# Altium project Kenworth_Overview_2.PrjPcb (part 4 of 4)

## Sheet Filter.SchDoc: <Document>
size Letter; Engineer: <Engineer>; Organization: UPEL; Address1: USU Power Electronics Lab; Address2: USTAR Building 620, RM 118; Address3: 1600 N 620 E; Address4: North Logan, UT 84341; DocumentNumber: 14; Revision: v1; SheetNumber: 14; SheetTotal: 16; ProjectName: <Project>
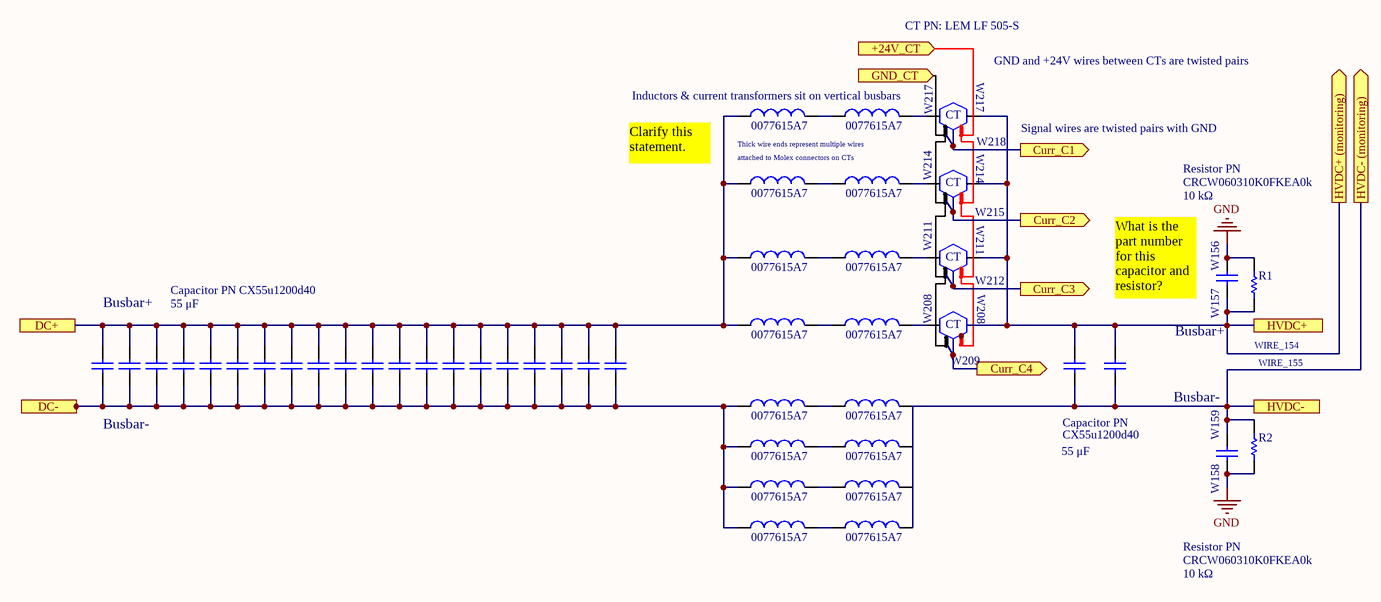
[diagram p15: Filter.SchDoc]

### Parts
(Parts that share a designator on the sheet are numbered #1, #2 ... from top to bottom, then left to right.)
*?#5  0077615A7
*?#6  0077615A7
*?#7  LEM LF 505-S  (value not drawn)
*?#8  0077615A7
*?#9  0077615A7
*?#10  LEM LF 505-S  (value not drawn)
*?#11  0077615A7
*?#12  0077615A7
*?#13  LEM LF 505-S  (value not drawn)
*?#14  0077615A7
*?#15  0077615A7
*?#16  CT PN: LEM LF 505-S
*?#17  0077615A7
*?#18  0077615A7
*?#19  0077615A7
*?#20  0077615A7
*?#21  0077615A7
*?#22  0077615A7
*?#23  0077615A7
*?#24  0077615A7
C?#1  Capacitor  (value not drawn)
C?#2  CX55u1200d40
C?#3  Capacitor PN CX55u1200d40
C?#4  Capacitor  (value not drawn)
C?#5  Capacitor  (value not drawn)
C?#6  Capacitor  (value not drawn)
C?#7  Capacitor  (value not drawn)
C?#8  Capacitor  (value not drawn)
C?#9  Capacitor  (value not drawn)
C?#10  Capacitor  (value not drawn)
C?#11  Capacitor  (value not drawn)
C?#12  Capacitor  (value not drawn)
C?#13  Capacitor  (value not drawn)
C?#14  Capacitor  (value not drawn)
C?#15  Capacitor  (value not drawn)
C?#16  Capacitor  (value not drawn)
C?#17  Capacitor  (value not drawn)
C?#18  Capacitor  (value not drawn)
C?#19  Capacitor  (value not drawn)
C?#20  Capacitor  (value not drawn)
C?#21  Capacitor  (value not drawn)
C?#22  Capacitor  (value not drawn)
C?#23  944U470K122AA  (value not drawn)
C?#24  Capacitor  (value not drawn)
R1  CRCW060310K0FKEA0k  [0603 RESISTOR]
R2  10k  [0603 RESISTOR]  (value not drawn)

### Ports
+24V_CT (in), Curr_C1 (out), Curr_C2 (out), Curr_C3 (out), Curr_C4 (out), DC+, DC-, GND_CT (in), HVDC+, HVDC+ (monitoring) (out), HVDC-, HVDC- (monitoring) (out)

### Nets
GND: C?#1.1 C?#24.1 R1.2 R2.2
DC+: C?#3.2 C?#4.2 C?#5.2 C?#6.2 C?#7.2 C?#8.2 C?#9.2 C?#10.2 C?#11.2 C?#12.2 C?#13.2 C?#14.2 C?#15.2 C?#16.2 C?#17.2 C?#18.2 C?#19.2 C?#20.2 C?#21.2 C?#22.2 ; port DC+
DC-: C?#3.1 C?#4.1 C?#5.1 C?#6.1 C?#7.1 C?#8.1 C?#9.1 C?#10.1 C?#11.1 C?#12.1 C?#13.1 C?#14.1 C?#15.1 C?#16.1 C?#17.1 C?#18.1 C?#19.1 C?#20.1 C?#21.1 C?#22.1 ; port DC-
HVDC+: *?#16.8 C?#1.2 C?#2.1 C?#23.2 R1.1 ; port HVDC+, port HVDC+ (monitoring)
HVDC-: C?#2.2 C?#23.1 C?#24.2 R2.1 ; port HVDC-, port HVDC- (monitoring)

Not connected (* = marked no-connect by the designer): *?#5 11 12; *?#6 11 12; *?#7 7 8; *?#8 11 12; *?#9 11 12; *?#10 7 8; *?#11 11 12; *?#12 11 12; *?#13 7 8; *?#14 11 12; *?#15 11 12; *?#16 7; *?#17 11 12; *?#18 11 12; *?#19 11 12; *?#20 11 12; *?#21 11 12; *?#22 11 12; *?#23 11 12; *?#24 11 12

### Notes on the sheet
- (near *?#7) W217
- (near *?#7) GND and +24V wires between CTs are twisted pairs
- (near *?#7) Inductors & current transformers sit on vertical busbars
- (near *?#5) Thick wire ends represent multiple wires
- (near *?#10) W214
- (near *?#7) W218
- (near *?#7) Signal wires are twisted pairs with GND
- (near *?#5) Clarify this statement.
- (near *?#8) attached to Molex connectors on CTs
- (near *?#10) W215
- 10 kΩ
- Resistor PN
- (near *?#13) W211
- (near *?#13) W212
- (near C?#1) W156
- (near C?#4) Busbar+
- (near C?#6) 55 μF
- (near *?#16) W208
- (near C?#1) What is the part number for this capacitor and resistor?
- Busbar+
- (near C?#1) W157
- WIRE_154
- (near *?#16) W209
- Busbar-
- WIRE_155
- (near C?#4) Busbar-
- 55 μF
- (near C?#23) Capacitor PN
- (near C?#24) W159
- (near C?#24) W158
- CRCW060310K0FKEA0k
- Project:
- Engineer:
- Document:
- Approved By:
- Date:
- Revision:
- File:
- Sheet
- of
- (in symbol Current_Sensor) CT

### Library data of the parts
*?#5 *?#6 *?#8 *?#9 *?#11 *?#12 *?#14 *?#15 *?#17-*?#24 = CMP-006-000014-3: 116.8 nH Toroid
*?#7 *?#10 *?#13 *?#16 = Current_Sensor
C?#1-C?#24 = Capacitor: SimulationGenericComponent: True; Value: 1p
R1 R2 = CRCW060310K0FKEA: 10 kOhms ±1% 0.1W, 1/10W Chip Resistor 0603 (1608 Metric) Automotive AEC-Q200 Thick Film; Supplier 1: Digi-Key; Supplier Part Number 1: 541-10.0KHCT-ND

## Sheet Rectifier.SchDoc: <Document>
size Letter; Engineer: <Engineer>; Organization: UPEL; Address1: USU Power Electronics Lab; Address2: USTAR Building 620, RM 118; Address3: 1600 N 620 E; Address4: North Logan, UT 84341; DocumentNumber: 13; Revision: v1; SheetNumber: 13; SheetTotal: 16; ProjectName: <Project>
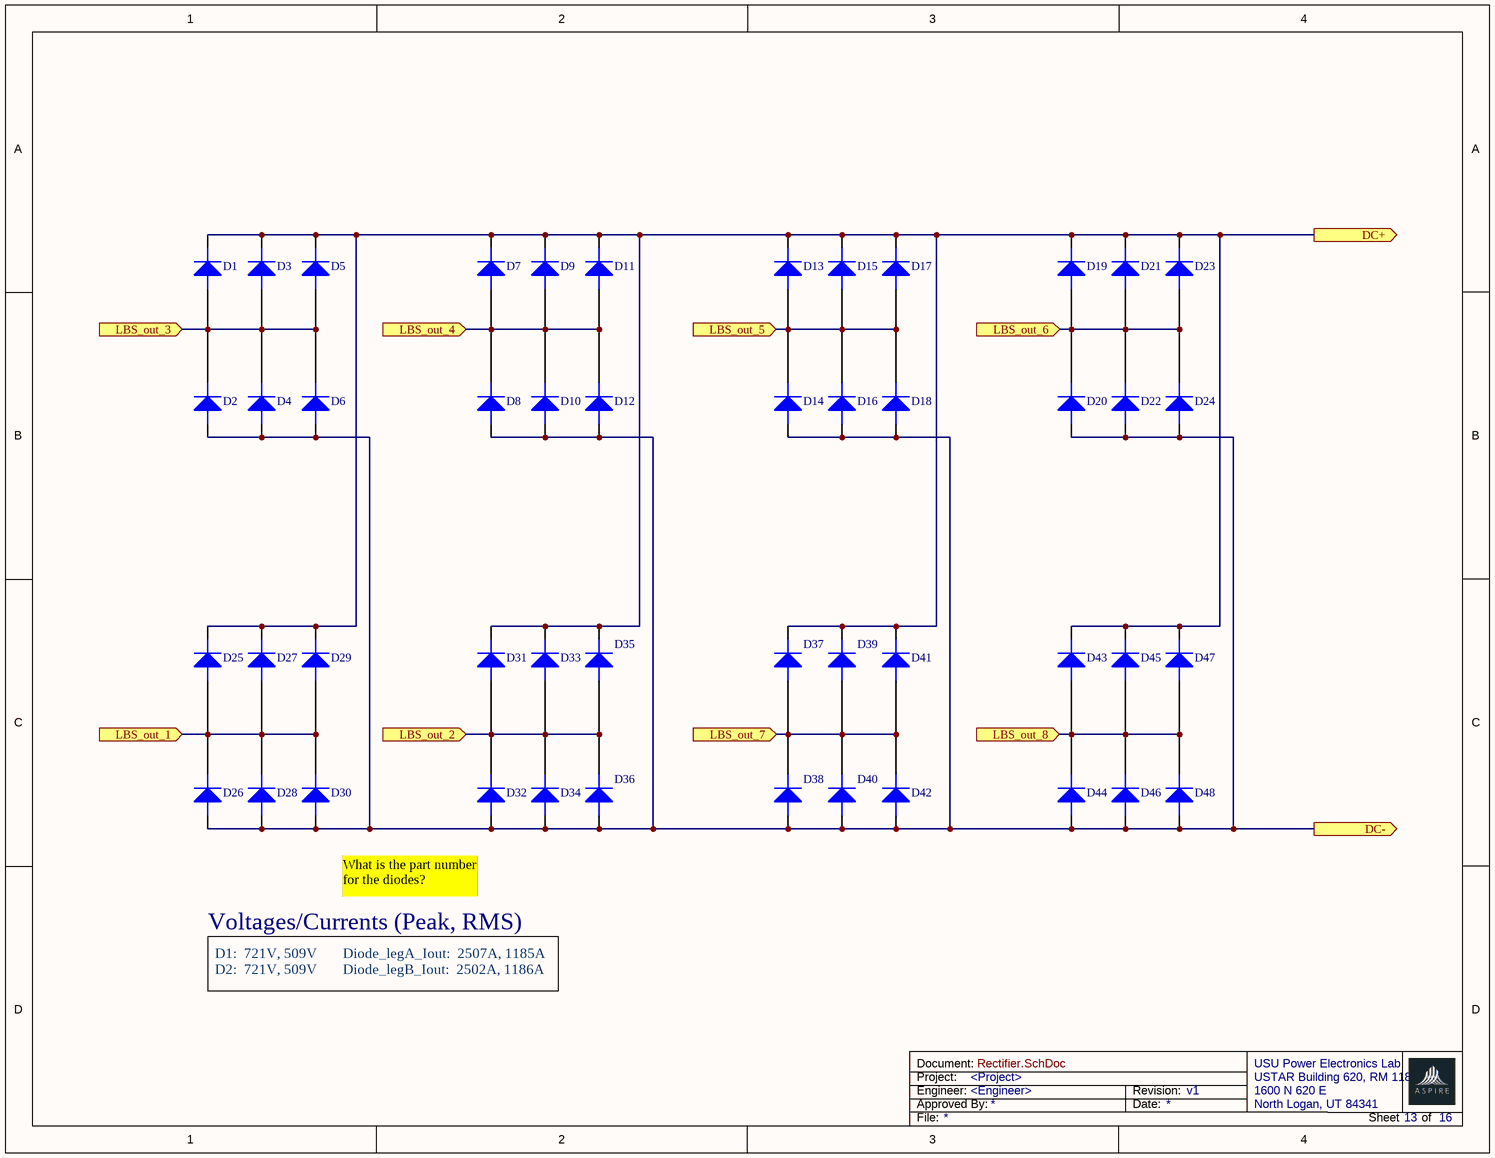
[diagram p16: Rectifier.SchDoc]

### Parts
(Parts that share a designator on the sheet are numbered #1, #2 ... from top to bottom, then left to right.)
D1#2  Diode  (value not drawn)
D2#2  Diode  (value not drawn)
D3#2  Diode  (value not drawn)
D4#2  Diode  (value not drawn)
D5#2  Diode  (value not drawn)
D6#2  Diode  (value not drawn)
D7  Diode  (value not drawn)
D8  Diode  (value not drawn)
D9  Diode  (value not drawn)
D10  Diode  (value not drawn)
D11  Diode  (value not drawn)
D12  Diode  (value not drawn)
D13  Diode  (value not drawn)
D14  Diode  (value not drawn)
D15  Diode  (value not drawn)
D16  Diode  (value not drawn)
D17  Diode  (value not drawn)
D18  Diode  (value not drawn)
D19  Diode  (value not drawn)
D20  Diode  (value not drawn)
D21  Diode  (value not drawn)
D22  Diode  (value not drawn)
D23  Diode  (value not drawn)
D24  Diode  (value not drawn)
D25  Diode  (value not drawn)
D26  Diode  (value not drawn)
D27  Diode  (value not drawn)
D28  Diode  (value not drawn)
D29  Diode  (value not drawn)
D30  Diode  (value not drawn)
D31  Diode  (value not drawn)
D32  Diode  (value not drawn)
D33  Diode  (value not drawn)
D34  Diode  (value not drawn)
D35  Diode  (value not drawn)
D36  Diode  (value not drawn)
D37  Diode  (value not drawn)
D38  Diode  (value not drawn)
D39  Diode  (value not drawn)
D40  Diode  (value not drawn)
D41  Diode  (value not drawn)
D42  Diode  (value not drawn)
D43  Diode  (value not drawn)
D44  Diode  (value not drawn)
D45  Diode  (value not drawn)
D46  Diode  (value not drawn)
D47  Diode  (value not drawn)
D48  Diode  (value not drawn)

### Ports
DC+ (out), DC- (out), LBS_out_1 (in), LBS_out_2 (in), LBS_out_3 (in), LBS_out_4 (in), LBS_out_5 (in), LBS_out_6 (in), LBS_out_7 (in), LBS_out_8 (in)

### Nets
DC+: D1#2.1 D3#2.1 D5#2.1 D7.1 D9.1 D11.1 D13.1 D15.1 D17.1 D19.1 D21.1 D23.1 D25.1 D27.1 D29.1 D31.1 D33.1 D35.1 D37.1 D39.1 D41.1 D43.1 D45.1 D47.1 ; port DC+
DC-: D2#2.0 D4#2.0 D6#2.0 D8.0 D10.0 D12.0 D14.0 D16.0 D18.0 D20.0 D22.0 D24.0 D26.0 D28.0 D30.0 D32.0 D34.0 D36.0 D38.0 D40.0 D42.0 D44.0 D46.0 D48.0 ; port DC-
LBS_out_1: D25.0 D26.1 D27.0 D28.1 D29.0 D30.1 ; port LBS_out_1
LBS_out_2: D31.0 D32.1 D33.0 D34.1 D35.0 D36.1 ; port LBS_out_2
LBS_out_3: D1#2.0 D2#2.1 D3#2.0 D4#2.1 D5#2.0 D6#2.1 ; port LBS_out_3
LBS_out_4: D7.0 D8.1 D9.0 D10.1 D11.0 D12.1 ; port LBS_out_4
LBS_out_5: D13.0 D14.1 D15.0 D16.1 D17.0 D18.1 ; port LBS_out_5
LBS_out_6: D19.0 D20.1 D21.0 D22.1 D23.0 D24.1 ; port LBS_out_6
LBS_out_7: D37.0 D38.1 D39.0 D40.1 D41.0 D42.1 ; port LBS_out_7
LBS_out_8: D43.0 D44.1 D45.0 D46.1 D47.0 D48.1 ; port LBS_out_8

### Notes on the sheet
- What is the part number for the diodes?
- Voltages/Currents (Peak, RMS)
- D1:  721V, 509V
  D2:  721V, 509V
- Diode_legA_Iout:  2507A, 1185A
  Diode_legB_Iout:  2502A, 1186A
- Project:
- Engineer:
- Document:
- Approved By:
- Date:
- Revision:
- File:
- Sheet
- of

## Sheet Underground_Assembly.SchDoc: <Document>
size Letter; Engineer: <Engineer>; Organization: UPEL; Address1: USU Power Electronics Lab; Address2: USTAR Building 620, RM 118; Address3: 1600 N 620 E; Address4: North Logan, UT 84341; DocumentNumber: 11; Revision: v1; SheetNumber: 11; SheetTotal: 16; ProjectName: <Project>
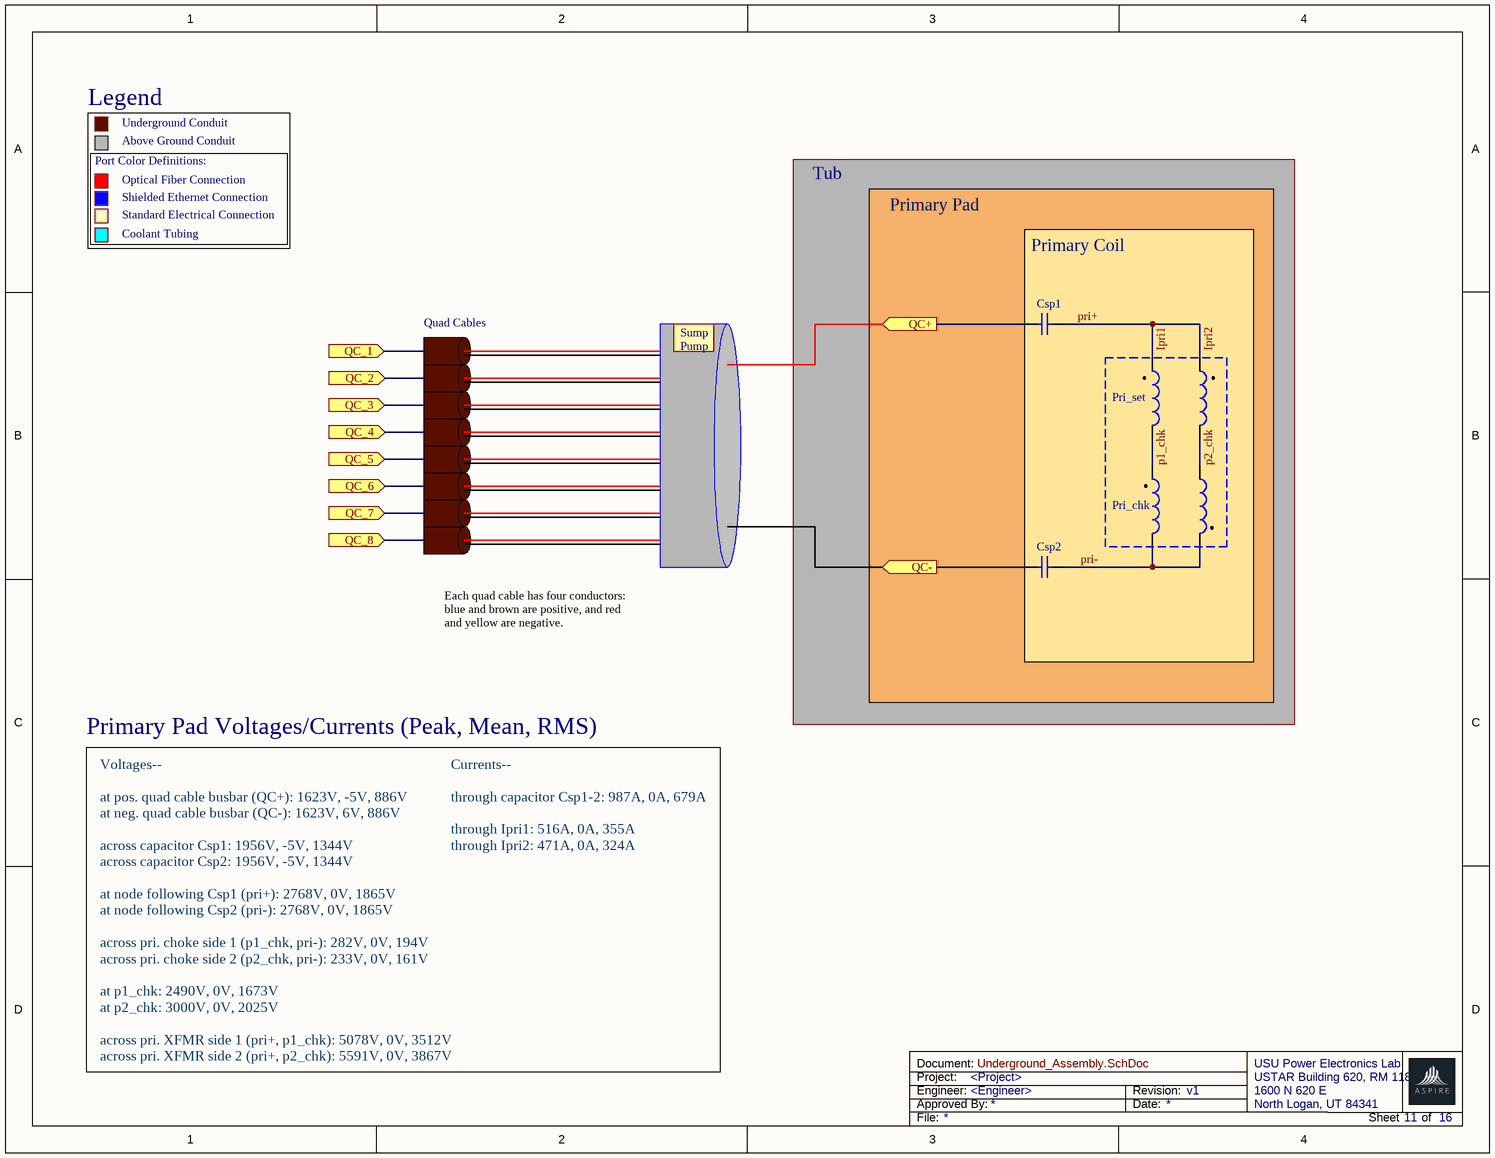
[diagram p17: Underground_Assembly.SchDoc]

### Parts
(Parts that share a designator on the sheet are numbered #1, #2 ... from top to bottom, then left to right.)
Csp1  Capacitor  (value not drawn)
Csp2  Capacitor  (value not drawn)
L?#11  Inductor  (value not drawn)
L?#12  Inductor  (value not drawn)
L?#13  Inductor  (value not drawn)
L?#14  Inductor  (value not drawn)

### Sub-sheets
Designator = File Name (file not in this document): no entries

### Ports
QC+ (in), QC- (in), QC_1 (in), QC_2 (in), QC_3 (in), QC_4 (in), QC_5 (in), QC_6 (in), QC_7 (in), QC_8 (in)

### Nets
Ipri1: Csp1.2 L?#11.2 L?#12.2  [also labelled Ipri2, pri+]
p1_chk: L?#11.1 L?#13.2
p2_chk: L?#12.1 L?#14.2
pri-: Csp2.2 L?#13.1 L?#14.1
QC+: Csp1.1 ; port QC+
QC-: Csp2.1 ; port QC-

### Notes on the sheet
- Legend
- Port Color Definitions:
- Underground Conduit
- Above Ground Conduit
- Optical Fiber Connection
- Shielded Ethernet Connection
- Standard Electrical Connection
- Coolant Tubing
- Tub
- Primary Pad
- Primary Coil
- Quad Cables
- Sump
  Pump
- (near L?#11) Pri_set
- (near L?#13) Pri_chk
- Each quad cable has four conductors: blue and brown are positive, and red and yellow are negative.
- Primary Pad Voltages/Currents (Peak, Mean, RMS)
- Currents--
  through capacitor Csp1-2: 987A, 0A, 679A
  through Ipri1: 516A, 0A, 355A
  through Ipri2: 471A, 0A, 324A
- Voltages--
  at pos. quad cable busbar (QC+): 1623V, -5V, 886V
  at neg. quad cable busbar (QC-): 1623V, 6V, 886V
  across capacitor Csp1: 1956V, -5V, 1344V
  across capacitor Csp2: 1956V, -5V, 1344V
  at node following Csp1 (pri+): 2768V, 0V, 1865V
  at node following Csp2 (pri-): 2768V, 0V, 1865V
  across pri. choke side 1 (p1_chk, pri-): 282V, 0V, 194V
  across pri. choke side 2 (p2_chk, pri-): 233V, 0V, 161V
  at p1_chk: 2490V, 0V, 1673V
  at p2_chk: 3000V, 0V, 2025V
  across pri. XFMR side 1 (pri+, p1_chk): 5078V, 0V, 3512V
  across pri. XFMR side 2 (pri+, p2_chk): 5591V, 0V, 3867V
- Project:
- Engineer:
- Document:
- Approved By:
- Date:
- Revision:
- File:
- Sheet
- of

### Library data of the parts
Csp1 = Capacitor: SimulationGenericComponent: True; Value: 1.66uF
Csp2 = Capacitor: SimulationGenericComponent: True; Value: 2.22uF
L?#11-L?#14 = Inductor: SimulationGenericComponent: True; Value: 1u

## Sheet Secondary_Pad_Auxiliary_Wiring_Overview.SchDoc
size A
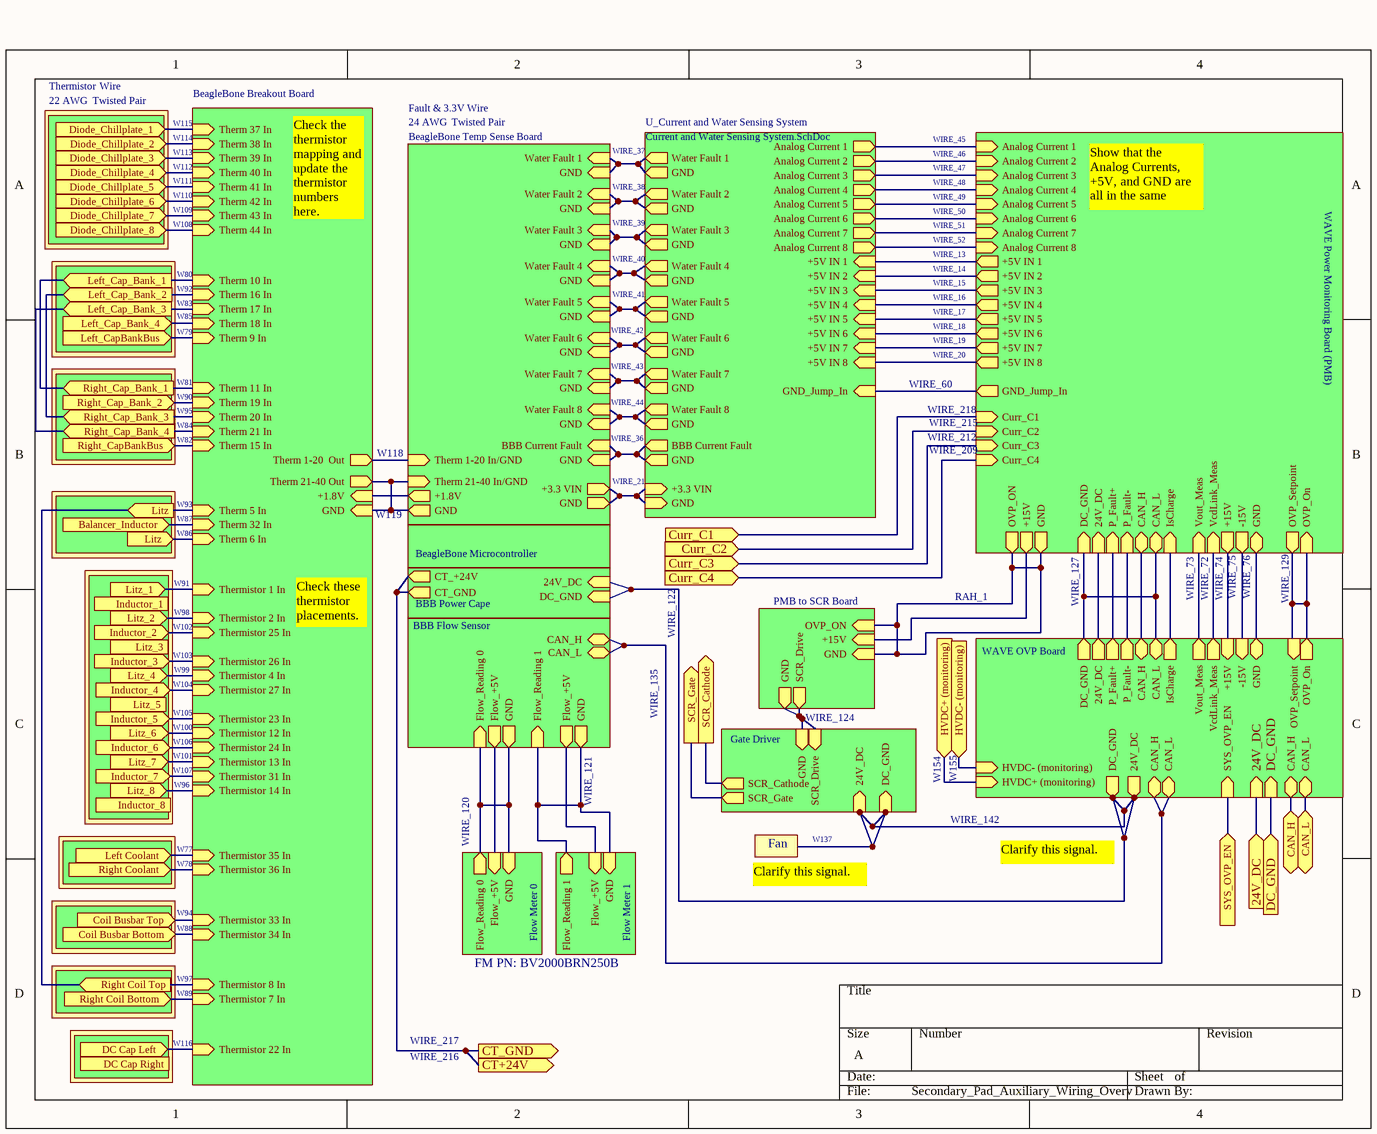
[diagram p18: Secondary_Pad_Auxiliary_Wiring_Overview.SchDoc]

### Sub-sheets
BBB Flow Sensor = File Name (file not in this document): CAN_H (bidir), CAN_L (bidir), Flow_+5V (out), GND (out), Flow_Reading 1 (in), Flow_Reading 0 (in), Flow_+5V (out), GND (out)
BBB Power Cape = File Name (file not in this document): DC_GND (in), 24V_DC (in), CT_GND (out), CT_+24V (out)
BeagleBone Breakout Board = BeagleBone Breakout Board (file not in this document): Therm 37 In (in), Therm 38 In (in), Therm 39 In (in), Therm 40 In (in), Therm 41 In (in), Therm 42 In (in), Therm 43 In (in), Therm 44 In (in), Therm 10 In (in), Therm 16 In (in), Therm 17 In (in), Therm 18 In (in), Therm 9 In (in), Therm 20 In (in), Therm 19 In (in), Therm 11 In (in), Therm 21 In (in), Therm 15 In (in), Therm 5 In (in), Therm 32 In (in), Therm 6 In (in), Thermistor 1 In (in), Thermistor 24 In (in), Thermistor 2 In (in), Thermistor 25 In (in), Thermistor 26 In (in), Thermistor 4 In (in), Thermistor 12 In (in), Thermistor 31 In (in), Thermistor 14 In (in), Thermistor 13 In (in), Therm 1-20  Out (out), Therm 21-40 Out (out), Thermistor 27 In (in), Thermistor 35 In (in), Thermistor 36 In (in), Thermistor 8 In (in), Thermistor 7 In (in), Thermistor 22 In (in), Thermistor 23 In (in), Thermistor 33 In (in), Thermistor 34 In (in), +1.8V (in), GND (in)
BeagleBone Microcontroller = File Name (file not in this document): no entries
BeagleBone Temp Sense Board = File Name (file not in this document): Water Fault 1 (in), Water Fault 5 (in), Water Fault 2 (in), Water Fault 4 (in), Water Fault 6 (in), Water Fault 7 (in), BBB Current Fault (in), Water Fault 8 (in), Therm 1-20 In/GND (in), Therm 21-40 In/GND (in), Water Fault 3 (in), GND (in), GND (in), GND (in), GND (in), GND (in), GND (in), GND (in), GND (in), GND (in), +1.8V (out), GND (out), +3.3 VIN (out), GND (out)
Coil 4 = File Name (file not in this document): no entries
Coil 4 = File Name (file not in this document): no entries
Coil 4 = File Name (file not in this document): no entries
Coil 4 = File Name (file not in this document): no entries
Coil 4 = File Name (file not in this document): no entries
Coil 4 = File Name (file not in this document): no entries
Coil 4 = File Name (file not in this document): no entries
Coil 4 = File Name (file not in this document): no entries
Coil 4 = File Name (file not in this document): no entries
Designator = WAVE OVP Board (file not in this document): Vout_Meas (out), VcdLink_Meas (out), GND (bidir), +15V (in), OVP_On (out), OVP_Setpoint (in), -15V (in), IsCharge (out), P_Fault- (out), P_Fault+ (out), 24V_DC (out), DC_GND (out), CAN_H (bidir), CAN_L (bidir), 24V_DC (in), DC_GND (in), SYS_OVP_EN (in), CAN_H (bidir), CAN_L (bidir), 24V_DC (out), DC_GND (out), CAN_H (bidir), CAN_L (bidir), HVDC- (monitoring) (in), HVDC+ (monitoring) (in)
Flow Meter 0 = File Name (file not in this document): Flow_Reading 0 (out), Flow_+5V (in), GND (in)
Flow Meter 1 = File Name (file not in this document): Flow_Reading 1 (out), Flow_+5V (in), GND (in)
Gate Driver = File Name (file not in this document): SCR_Drive (in), GND (in), SCR_Cathode (out), SCR_Gate (out), DC_GND (in), 24V_DC (in)
PMB to SCR Board = File Name (file not in this document): GND (in), OVP_ON (in), SCR_Drive (out), GND (out), +15V (in)
U_Current and Water Sensing System = Current and Water Sensing System.SchDoc (file not in this document): Water Fault 1 (out), Water Fault 2 (out), Water Fault 3 (out), Water Fault 4 (out), Water Fault 5 (out), Water Fault 6 (out), Water Fault 7 (out), Water Fault 8 (out), BBB Current Fault (out), Analog Current 1 (out), Analog Current 2 (out), Analog Current 3 (out), Analog Current 4 (out), Analog Current 5 (out), Analog Current 6 (out), Analog Current 7 (out), Analog Current 8 (out), +5V IN 1 (in), +5V IN 2 (in), +5V IN 3 (in), +5V IN 4 (in), +5V IN 5 (in), +5V IN 6 (in), +5V IN 7 (in), +5V IN 8 (in), GND (out), GND (out), GND (out), GND (out), GND (out), GND (out), GND (out), GND (out), GND (out), GND_Jump_In (in), +3.3 VIN (in), GND (in)
WAVE Power Monitoring Board (PMB) = File Name (file not in this document): +5V IN 1 (out), +5V IN 2 (out), +5V IN 3 (out), +5V IN 4 (out), +5V IN 5 (out), +5V IN 6 (out), +5V IN 7 (out), +5V IN 8 (out), Vout_Meas (in), VcdLink_Meas (in), GND (bidir), -15V (out), +15V (out), IsCharge (in), P_Fault- (in), P_Fault+ (in), Analog Current 1 (in), Analog Current 2 (in), Analog Current 3 (in), Analog Current 4 (in), Analog Current 5 (in), Analog Current 6 (in), Analog Current 7 (in), Analog Current 8 (in), GND_Jump_In (out), 24V_DC (in), DC_GND (in), OVP_Setpoint (out), OVP_On (in), Curr_C2 (in), Curr_C1 (in), Curr_C4 (in), Curr_C3 (in), CAN_H (bidir), CAN_L (bidir), +15V (out), OVP_ON (out), GND (out)

### Ports
24V_DC (in), Balancer_Inductor (in), CAN_H (bidir), CAN_L (bidir), Coil Busbar Bottom (in), Coil Busbar Top (in), CT+24V (out), CT_GND (out), Curr_C1 (in), Curr_C2 (in), Curr_C3 (in), Curr_C4 (in), DC Cap Left (in), DC Cap Right (in), DC_GND (in), Diode_Chillplate_1 (in), Diode_Chillplate_2 (in), Diode_Chillplate_3 (in), Diode_Chillplate_4 (in), Diode_Chillplate_5 (in), Diode_Chillplate_6 (in), Diode_Chillplate_7 (in), Diode_Chillplate_8 (in), HVDC+ (monitoring) (in), HVDC- (monitoring) (in), Inductor_1 (in), Inductor_2 (in), Inductor_3 (in), Inductor_4 (in), Inductor_5 (in), Inductor_6 (in), Inductor_7 (in), Inductor_8 (in), Left Coolant (in), Left_Cap_Bank_1 (in), Left_Cap_Bank_2 (in), Left_Cap_Bank_3 (in), Left_Cap_Bank_4 (in), Left_CapBankBus (in), Litz (in), Litz_1 (in), Litz_2 (in), Litz_3 (in), Litz_4 (in), Litz_5 (in), Litz_6 (in), Litz_7 (in), Litz_8 (in), Right Coil Bottom (in), Right Coil Top (in), Right Coolant (in), Right_Cap_Bank_1 (in), Right_Cap_Bank_2 (in), Right_Cap_Bank_3 (in), Right_Cap_Bank_4 (in), Right_CapBankBus (in), SCR_Cathode (out), SCR_Gate (out), SYS_OVP_EN (in)

### Nets
24V_DC: port 24V_DC, sheet Designator/24V_DC
Balancer_Inductor: port Balancer_Inductor, sheet BeagleBone Breakout Board/Therm 32 In
CAN_H: port CAN_H, sheet Designator/CAN_H
CAN_L: port CAN_L, sheet Designator/CAN_L
Coil Busbar Bottom: port Coil Busbar Bottom, sheet BeagleBone Breakout Board/Thermistor 34 In
Coil Busbar Top: port Coil Busbar Top, sheet BeagleBone Breakout Board/Thermistor 33 In
CT+24V: port CT_GND, port CT+24V, sheet BBB Power Cape/CT_GND, sheet BBB Power Cape/CT_+24V
Curr_C1: port Curr_C1, sheet WAVE Power Monitoring Board (PMB)/Curr_C1
Curr_C2: port Curr_C2, sheet WAVE Power Monitoring Board (PMB)/Curr_C2
Curr_C3: port Curr_C3, sheet WAVE Power Monitoring Board (PMB)/Curr_C3
Curr_C4: port Curr_C4, sheet WAVE Power Monitoring Board (PMB)/Curr_C4
DC Cap Left: port DC Cap Left, sheet BeagleBone Breakout Board/Thermistor 22 In
DC_GND: port DC_GND, sheet Designator/DC_GND
Diode_Chillplate_1: port Diode_Chillplate_1, sheet BeagleBone Breakout Board/Therm 37 In
Diode_Chillplate_2: port Diode_Chillplate_2, sheet BeagleBone Breakout Board/Therm 38 In
Diode_Chillplate_3: port Diode_Chillplate_3, sheet BeagleBone Breakout Board/Therm 39 In
Diode_Chillplate_4: port Diode_Chillplate_4, sheet BeagleBone Breakout Board/Therm 40 In
Diode_Chillplate_5: port Diode_Chillplate_5, sheet BeagleBone Breakout Board/Therm 41 In
Diode_Chillplate_6: port Diode_Chillplate_6, sheet BeagleBone Breakout Board/Therm 42 In
Diode_Chillplate_7: port Diode_Chillplate_7, sheet BeagleBone Breakout Board/Therm 43 In
Diode_Chillplate_8: port Diode_Chillplate_8, sheet BeagleBone Breakout Board/Therm 44 In
HVDC+ (monitoring): port HVDC+ (monitoring), sheet Designator/HVDC+ (monitoring)
HVDC- (monitoring): port HVDC- (monitoring), sheet Designator/HVDC- (monitoring)
Inductor_2: port Inductor_2, sheet BeagleBone Breakout Board/Thermistor 25 In
Inductor_3: port Inductor_3, sheet BeagleBone Breakout Board/Thermistor 26 In
Inductor_4: port Inductor_4, sheet BeagleBone Breakout Board/Thermistor 27 In
Inductor_5: port Inductor_5, sheet BeagleBone Breakout Board/Thermistor 23 In
Inductor_6: port Inductor_6, sheet BeagleBone Breakout Board/Thermistor 24 In
Inductor_7: port Inductor_7, sheet BeagleBone Breakout Board/Thermistor 31 In
Left Coolant: port Left Coolant, sheet BeagleBone Breakout Board/Thermistor 35 In
Left_Cap_Bank_1: port Right_Cap_Bank_1, port Left_Cap_Bank_1, sheet BeagleBone Breakout Board/Therm 10 In, sheet BeagleBone Breakout Board/Therm 11 In
Left_Cap_Bank_2: port Right_Cap_Bank_3, port Left_Cap_Bank_2, sheet BeagleBone Breakout Board/Therm 16 In, sheet BeagleBone Breakout Board/Therm 20 In
Left_Cap_Bank_3: port Right_Cap_Bank_4, port Left_Cap_Bank_3, sheet BeagleBone Breakout Board/Therm 17 In, sheet BeagleBone Breakout Board/Therm 21 In
Left_Cap_Bank_4: port Left_Cap_Bank_4, sheet BeagleBone Breakout Board/Therm 18 In
Left_CapBankBus: port Left_CapBankBus, sheet BeagleBone Breakout Board/Therm 9 In
Litz: port Litz, port Right Coil Top, sheet BeagleBone Breakout Board/Therm 5 In, sheet BeagleBone Breakout Board/Therm 6 In, sheet BeagleBone Breakout Board/Thermistor 8 In
Litz_1: port Litz_1, sheet BeagleBone Breakout Board/Thermistor 1 In
Litz_2: port Litz_2, sheet BeagleBone Breakout Board/Thermistor 2 In
Litz_4: port Litz_4, sheet BeagleBone Breakout Board/Thermistor 4 In
Litz_6: port Litz_6, sheet BeagleBone Breakout Board/Thermistor 12 In
Litz_7: port Litz_7, sheet BeagleBone Breakout Board/Thermistor 13 In
Litz_8: port Litz_8, sheet BeagleBone Breakout Board/Thermistor 14 In
Right Coil Bottom: port Right Coil Bottom, sheet BeagleBone Breakout Board/Thermistor 7 In
Right Coolant: port Right Coolant, sheet BeagleBone Breakout Board/Thermistor 36 In
Right_Cap_Bank_2: port Right_Cap_Bank_2, sheet BeagleBone Breakout Board/Therm 19 In
Right_CapBankBus: port Right_CapBankBus, sheet BeagleBone Breakout Board/Therm 15 In
SCR_Cathode: port SCR_Cathode, sheet Gate Driver/SCR_Cathode
SCR_Gate: port SCR_Gate, sheet Gate Driver/SCR_Gate
SYS_OVP_EN: port SYS_OVP_EN, sheet Designator/SYS_OVP_EN
(unnamed): sheet BBB Power Cape/24V_DC, sheet Gate Driver/DC_GND, sheet Gate Driver/24V_DC, sheet Designator/24V_DC, sheet Designator/DC_GND
(unnamed): sheet BBB Flow Sensor/CAN_H, sheet BBB Flow Sensor/CAN_L, sheet Designator/CAN_H, sheet Designator/CAN_L
(unnamed): sheet BBB Flow Sensor/Flow_+5V, sheet Flow Meter 0/Flow_+5V
(unnamed): sheet BBB Flow Sensor/GND, sheet BBB Flow Sensor/Flow_Reading 0, sheet Flow Meter 0/Flow_Reading 0, sheet Flow Meter 0/GND
(unnamed): sheet BBB Flow Sensor/Flow_Reading 1, sheet BBB Flow Sensor/GND, sheet Flow Meter 1/Flow_Reading 1, sheet Flow Meter 1/GND
(unnamed): sheet BBB Flow Sensor/Flow_+5V, sheet Flow Meter 1/Flow_+5V
(unnamed): sheet BeagleBone Temp Sense Board/Water Fault 1, sheet BeagleBone Temp Sense Board/GND, sheet U_Current and Water Sensing System/Water Fault 1, sheet U_Current and Water Sensing System/GND
(unnamed): sheet BeagleBone Temp Sense Board/Water Fault 5, sheet BeagleBone Temp Sense Board/GND, sheet U_Current and Water Sensing System/Water Fault 5, sheet U_Current and Water Sensing System/GND
(unnamed): sheet BeagleBone Temp Sense Board/Water Fault 2, sheet BeagleBone Temp Sense Board/GND, sheet U_Current and Water Sensing System/Water Fault 2, sheet U_Current and Water Sensing System/GND
(unnamed): sheet BeagleBone Temp Sense Board/Water Fault 4, sheet BeagleBone Temp Sense Board/GND, sheet U_Current and Water Sensing System/Water Fault 4, sheet U_Current and Water Sensing System/GND
(unnamed): sheet BeagleBone Temp Sense Board/Water Fault 6, sheet BeagleBone Temp Sense Board/GND, sheet U_Current and Water Sensing System/Water Fault 6, sheet U_Current and Water Sensing System/GND
(unnamed): sheet BeagleBone Temp Sense Board/Water Fault 7, sheet BeagleBone Temp Sense Board/GND, sheet U_Current and Water Sensing System/Water Fault 7, sheet U_Current and Water Sensing System/GND
(unnamed): sheet BeagleBone Temp Sense Board/BBB Current Fault, sheet BeagleBone Temp Sense Board/GND, sheet U_Current and Water Sensing System/BBB Current Fault, sheet U_Current and Water Sensing System/GND
(unnamed): sheet BeagleBone Temp Sense Board/Water Fault 8, sheet BeagleBone Temp Sense Board/GND, sheet U_Current and Water Sensing System/Water Fault 8, sheet U_Current and Water Sensing System/GND
(unnamed): sheet BeagleBone Temp Sense Board/Therm 1-20 In/GND, sheet BeagleBone Breakout Board/Therm 1-20  Out
(unnamed): sheet BeagleBone Temp Sense Board/Therm 21-40 In/GND, sheet BeagleBone Temp Sense Board/GND, sheet BeagleBone Breakout Board/Therm 21-40 Out, sheet BeagleBone Breakout Board/GND
(unnamed): sheet BeagleBone Temp Sense Board/Water Fault 3, sheet BeagleBone Temp Sense Board/GND, sheet U_Current and Water Sensing System/Water Fault 3, sheet U_Current and Water Sensing System/GND
(unnamed): sheet BeagleBone Temp Sense Board/+1.8V, sheet BeagleBone Breakout Board/+1.8V
(unnamed): sheet BeagleBone Temp Sense Board/+3.3 VIN, sheet BeagleBone Temp Sense Board/GND, sheet U_Current and Water Sensing System/+3.3 VIN, sheet U_Current and Water Sensing System/GND
(unnamed): sheet U_Current and Water Sensing System/Analog Current 1, sheet WAVE Power Monitoring Board (PMB)/Analog Current 1
(unnamed): sheet U_Current and Water Sensing System/Analog Current 2, sheet WAVE Power Monitoring Board (PMB)/Analog Current 2
(unnamed): sheet U_Current and Water Sensing System/Analog Current 3, sheet WAVE Power Monitoring Board (PMB)/Analog Current 3
(unnamed): sheet U_Current and Water Sensing System/Analog Current 4, sheet WAVE Power Monitoring Board (PMB)/Analog Current 4
(unnamed): sheet U_Current and Water Sensing System/Analog Current 5, sheet WAVE Power Monitoring Board (PMB)/Analog Current 5
(unnamed): sheet U_Current and Water Sensing System/Analog Current 6, sheet WAVE Power Monitoring Board (PMB)/Analog Current 6
(unnamed): sheet U_Current and Water Sensing System/Analog Current 7, sheet WAVE Power Monitoring Board (PMB)/Analog Current 7
(unnamed): sheet U_Current and Water Sensing System/Analog Current 8, sheet WAVE Power Monitoring Board (PMB)/Analog Current 8
(unnamed): sheet U_Current and Water Sensing System/+5V IN 1, sheet WAVE Power Monitoring Board (PMB)/+5V IN 1
(unnamed): sheet U_Current and Water Sensing System/+5V IN 2, sheet WAVE Power Monitoring Board (PMB)/+5V IN 2
(unnamed): sheet U_Current and Water Sensing System/+5V IN 3, sheet WAVE Power Monitoring Board (PMB)/+5V IN 3
(unnamed): sheet U_Current and Water Sensing System/+5V IN 4, sheet WAVE Power Monitoring Board (PMB)/+5V IN 4
(unnamed): sheet U_Current and Water Sensing System/+5V IN 5, sheet WAVE Power Monitoring Board (PMB)/+5V IN 5
(unnamed): sheet U_Current and Water Sensing System/+5V IN 6, sheet WAVE Power Monitoring Board (PMB)/+5V IN 6
(unnamed): sheet U_Current and Water Sensing System/+5V IN 7, sheet WAVE Power Monitoring Board (PMB)/+5V IN 7
(unnamed): sheet U_Current and Water Sensing System/+5V IN 8, sheet WAVE Power Monitoring Board (PMB)/+5V IN 8
(unnamed): sheet U_Current and Water Sensing System/GND_Jump_In, sheet WAVE Power Monitoring Board (PMB)/GND_Jump_In
(unnamed): sheet WAVE Power Monitoring Board (PMB)/Vout_Meas, sheet Designator/Vout_Meas
(unnamed): sheet WAVE Power Monitoring Board (PMB)/VcdLink_Meas, sheet Designator/VcdLink_Meas
(unnamed): sheet WAVE Power Monitoring Board (PMB)/GND, sheet Designator/GND
(unnamed): sheet WAVE Power Monitoring Board (PMB)/-15V, sheet Designator/-15V
(unnamed): sheet WAVE Power Monitoring Board (PMB)/+15V, sheet Designator/+15V
(unnamed): sheet WAVE Power Monitoring Board (PMB)/IsCharge, sheet Designator/IsCharge
(unnamed): sheet WAVE Power Monitoring Board (PMB)/P_Fault-, sheet Designator/P_Fault-
(unnamed): sheet WAVE Power Monitoring Board (PMB)/P_Fault+, sheet Designator/P_Fault+
(unnamed): sheet WAVE Power Monitoring Board (PMB)/24V_DC, sheet Designator/24V_DC
(unnamed): sheet WAVE Power Monitoring Board (PMB)/DC_GND, sheet WAVE Power Monitoring Board (PMB)/CAN_L, sheet Designator/DC_GND, sheet Designator/CAN_L
(unnamed): sheet WAVE Power Monitoring Board (PMB)/OVP_Setpoint, sheet WAVE Power Monitoring Board (PMB)/OVP_On, sheet Designator/OVP_On
(unnamed): sheet WAVE Power Monitoring Board (PMB)/CAN_H, sheet Designator/CAN_H
(unnamed): sheet WAVE Power Monitoring Board (PMB)/+15V, sheet PMB to SCR Board/+15V
(unnamed): sheet WAVE Power Monitoring Board (PMB)/OVP_ON, sheet WAVE Power Monitoring Board (PMB)/GND, sheet PMB to SCR Board/OVP_ON
(unnamed): sheet PMB to SCR Board/SCR_Drive, sheet PMB to SCR Board/GND, sheet Gate Driver/SCR_Drive, sheet Gate Driver/GND

### Notes on the sheet
- 22 AWG
- Thermistor
- Twisted Pair
- Wire
- W115
- W114
- W113
- 24 AWG
- Fault & 3.3V Wire
- WIRE_37
- WIRE_45
- W112
- W111
- W110
- W109
- Check the thermistor mapping and update the thermistor numbers here.
- WIRE_38
- WIRE_39
- WIRE_46
- WIRE_47
- WIRE_48
- WIRE_49
- WIRE_50
- Show that the Analog Currents, +5V, and GND are all in the same insulated jacket.
- W108
- W80
- W92
- WIRE_40
- WIRE_41
- WIRE_13
- WIRE_14
- WIRE_15
- WIRE_51
- WIRE_52
- W83
- W85
- W79
- WIRE_42
- WIRE_43
- WIRE_16
- WIRE_17
- WIRE_18
- WIRE_20
- WIRE_19
- W81
- W90
- W95
- W84
- W82
- WIRE_44
- WIRE_36
- WIRE_60
- WIRE_218
- WIRE_212
- WIRE_215
- W93
- W118
- WIRE_21
- WIRE_209
- W91
- W87
- W86
- W119
- W102
- W98
- Check these thermistor placements.
- WIRE_122
- RAH_1
- WIRE_127
- WIRE_73
- WIRE_72
- WIRE_74
- WIRE_75
- WIRE_76
- WIRE_129
- W103
- W104
- W105
- W100
- W99
- WIRE_135
- WIRE_124
- W106
- W101
- W107
- W96
- W154
- W155
- W77
- W78
- WIRE_120
- WIRE_121
- Fan
- W137
- WIRE_142
- Clarify this signal.
- W94
- W88
- W97
- W89
- FM PN: BV2000BRN250B
- W116
- WIRE_217
- WIRE_216

## Nets that join several sheets
Phase_A': Special_Equipment_Cabinet_Overview (F68.2), Shunt_Filter (J2.0)
Phase_B': Special_Equipment_Cabinet_Overview (F70.2), Shunt_Filter (J1.0)
Phase_C': Special_Equipment_Cabinet_Overview (F72.2), Shunt_Filter (J3.0)
120 V: Special_Equipment_Cabinet_Overview (T1.3), Auxiliary_Circuit (J19.0)
DC+: Filter (20 pins), Rectifier (24 pins)
DC-: Filter (20 pins), Rectifier (24 pins)
HVDC+: Vehicle_Charger_Hierarchal (SCR.2 SCR.3), Filter (5 pins)
HVDC-: Vehicle_Charger_Hierarchal (7 pins), Filter (C?#2.2 C?#23.1 C?#24.2 R2.1)
Inductors_OUT: Shunt_Filter (J4.0), Special Equipment Cabinet/Shunt Filter/U_RLC (J14_Special_Equipment_Cabinet_Shunt_Filter_U_RLC#1.0)
Inductors_OUT: Shunt_Filter (J4.0), Special Equipment Cabinet/Shunt Filter/U_RLC (J14_Special_Equipment_Cabinet_Shunt_Filter_U_RLC#2.0)
Inductors_OUT: Shunt_Filter (J4.0), Special Equipment Cabinet/Shunt Filter/U_RLC (J14_Special_Equipment_Cabinet_Shunt_Filter_U_RLC#3.0)
LBS_out_1: Vehicle_Charger_Hierarchal (Lbr1.2), Rectifier (6 pins)
LBS_out_2: Vehicle_Charger_Hierarchal (Lbr2.2), Rectifier (6 pins)
LBS_out_3: Vehicle_Charger_Hierarchal (Lbr3.2), Rectifier (6 pins)
LBS_out_4: Vehicle_Charger_Hierarchal (Lbr4.2), Rectifier (6 pins)
LBS_out_5: Vehicle_Charger_Hierarchal (Lbr5.2), Rectifier (6 pins)
LBS_out_6: Vehicle_Charger_Hierarchal (Lbr6.2), Rectifier (6 pins)
LBS_out_7: Vehicle_Charger_Hierarchal (Lbr7.2), Rectifier (6 pins)
LBS_out_8: Vehicle_Charger_Hierarchal (Lbr8.2), Rectifier (6 pins)
N: Fuse_Block (16 pins), Unfolder (5 pins)
N: Special_Equipment_Cabinet_Overview (T1.4), Auxiliary_Circuit (J19.0)
N: Special_Equipment_Cabinet_Overview (J17.1), Shunt_Filter (J4.0)
O: Full_Module (K?#2.4), U_T-Type_Board (C9_U_T-Type_Board#1.1 C11_U_T-Type_Board#1.2 Q17_U_T-Type_Board#1.4 Q21_U_T-Type_Board#1.4)
O: Full_Module (K?#5.4), U_T-Type_Board (C9_U_T-Type_Board#2.1 C11_U_T-Type_Board#2.2 Q17_U_T-Type_Board#2.4 Q21_U_T-Type_Board#2.4)
O: Fuse_Block (16 pins), Unfolder (C1.2 C2.1)
P: Fuse_Block (16 pins), Unfolder (5 pins)
Phase_A_F5_OUT: Shunt_Filter (F14.1), Special Equipment Cabinet/Shunt Filter/U_RLC (C5_Special_Equipment_Cabinet_Shunt_Filter_U_RLC#1.2 ROX5SSJ47K_Special_Equipment_Cabinet_Shunt_Filter_U_RLC#1.2)
PP+: Full_Module (C2-1#2.2 L2#2.1), IGBT PCB (6 pins)
PP+: Full_Module (C2-1#1.2 L2#1.1), IGBT PCB (6 pins)
PP-: Full_Module (C2-3#2.1 L?#5.2), IGBT PCB (6 pins)
PP-: Full_Module (C2-3#1.1 L?#2.2), IGBT PCB (6 pins)
Resistors_OUT: Shunt_Filter (J4.0), Special Equipment Cabinet/Shunt Filter/U_RLC (J15_Special_Equipment_Cabinet_Shunt_Filter_U_RLC#1.0)
Resistors_OUT: Shunt_Filter (J4.0), Special Equipment Cabinet/Shunt Filter/U_RLC (J15_Special_Equipment_Cabinet_Shunt_Filter_U_RLC#2.0)
Resistors_OUT: Shunt_Filter (J4.0), Special Equipment Cabinet/Shunt Filter/U_RLC (J15_Special_Equipment_Cabinet_Shunt_Filter_U_RLC#3.0)